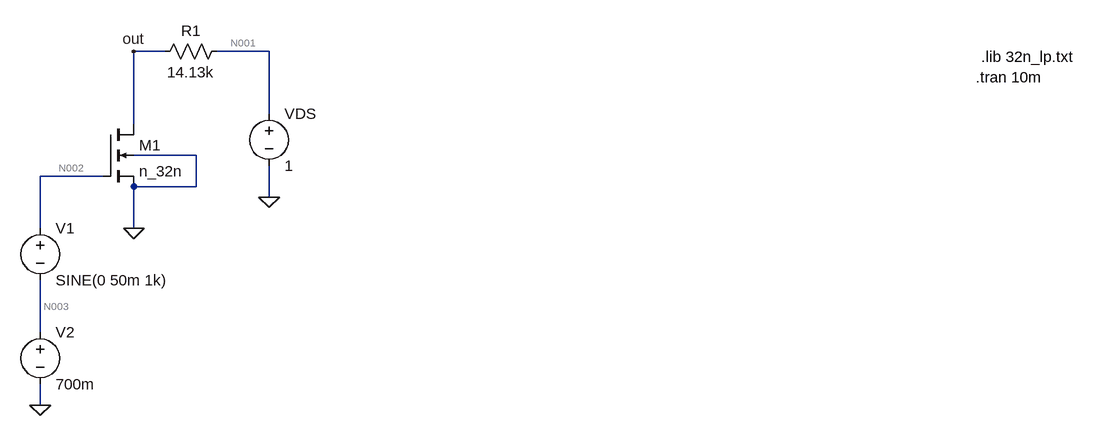
[diagram p0: schematic 32n_lp_cs_res.asc]
32n_lp_cs_res.asc, the LTspice schematic file:
Version 4
SHEET 1 1744 680
WIRE -64 -320 -112 -320
WIRE 96 -320 16 -320
WIRE 96 -224 96 -320
WIRE -112 -208 -112 -320
WIRE -16 -160 -112 -160
WIRE -160 -128 -256 -128
WIRE -16 -112 -16 -160
WIRE -16 -112 -112 -112
WIRE 96 -96 96 -144
WIRE -256 -48 -256 -128
WIRE -112 -48 -112 -112
WIRE -256 112 -256 32
WIRE -256 224 -256 192
FLAG -112 -48 0
FLAG 96 -96 0
FLAG -112 -320 out
FLAG -256 224 0
SYMBOL nmos4 -160 -208 R0
SYMATTR InstName M1
SYMATTR Value n_32n
SYMATTR Value2 l=96n w=1.8u
SYMBOL voltage 96 -240 R0
WINDOW 123 0 0 Left 0
WINDOW 39 0 0 Left 0
SYMATTR InstName VDS
SYMATTR Value 1
SYMBOL res 32 -336 R90
WINDOW 0 0 56 VBottom 2
WINDOW 3 32 56 VTop 2
SYMATTR InstName R1
SYMATTR Value 14.13k
SYMBOL voltage -256 -64 R0
WINDOW 123 0 0 Left 0
WINDOW 39 0 0 Left 0
SYMATTR InstName V1
SYMATTR Value SINE(0 50m 1k)
SYMBOL voltage -256 96 R0
WINDOW 123 0 0 Left 0
WINDOW 39 0 0 Left 0
SYMATTR InstName V2
SYMATTR Value 700m
TEXT 1192 -312 Left 2 !.lib 32n_lp.txt
TEXT 1184 -280 Left 2 !.tran 10m

The netlist it stands for:
* 32n_lp_cs_res.asc
M1 out N002 0 0 n_32n l=96n w=1.8u
VDS N001 0 1
R1 N001 out 14.13k
V1 N002 N003 SINE(0 50m 1k)
V2 N003 0 700m
.model NMOS NMOS
.model PMOS PMOS
.lib standard.mos
.lib 32n_lp.txt
.tran 10m
.backanno
.end

* Results of the author's LTspice run, read from the files saved beside the schematic
* Operating Point, zero values left out:
*   V(out) = 500.1 mV
*   V(n002) = 700 mV
*   V(n001) = 1 V
*   V(n003) = 700 mV
*   Id(M1) = 35.38 µA
*   Ig(M1) = 93.15 pA
*   Is(M1) = -35.38 µA
*   I(R1) = 35.38 µA
*   I(V2) = -93.15 pA
*   I(V1) = -93.15 pA
*   I(Vds) = -35.38 µA
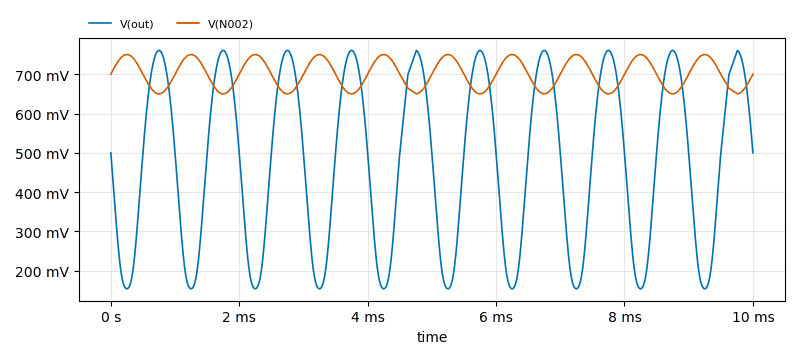
[diagram p1: Transient Analysis of 32n_lp_cs_res.asc, plotted from the saved traces]
* Transient Analysis, 1 run:
*   V(out): min 154.2 mV, max 760.6 mV, average 474 mV, rms 523.4 mV, last 500.1 mV
*   V(N002): min 650 mV, max 750 mV, average 700.1 mV, rms 701 mV, last 700 mV